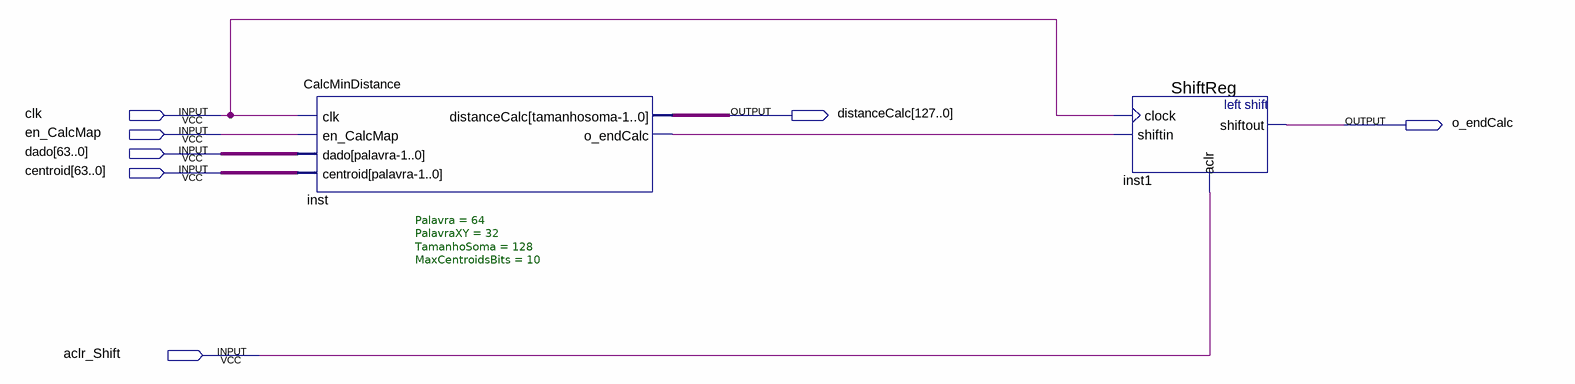
[diagram p0: schematic sheet]
// Quartus schematic Kmeans_CalcMap.bdf as structural Verilog: 2 symbols, 7 pins
module Kmeans_CalcMap (
  input  clk,
  input  en_CalcMap,
  input  [63:0] dado,
  input  [63:0] centroid,
  input  aclr_Shift,
  output [127:0] distanceCalc,
  output o_endCalc
);

  wire inst_o_endcalc;

  CalcMinDistance #(.Palavra(64), .PalavraXY(32), .TamanhoSoma(128), .MaxCentroidsBits(10)) inst (
    .clk(clk), .en_CalcMap(en_CalcMap), .dado(dado), .centroid(centroid), .distanceCalc(distanceCalc),
    .o_endCalc(inst_o_endcalc));
  ShiftReg inst1 (.clock(clk), .shiftin(inst_o_endcalc), .aclr(aclr_Shift), .shiftout(o_endCalc));
endmodule
